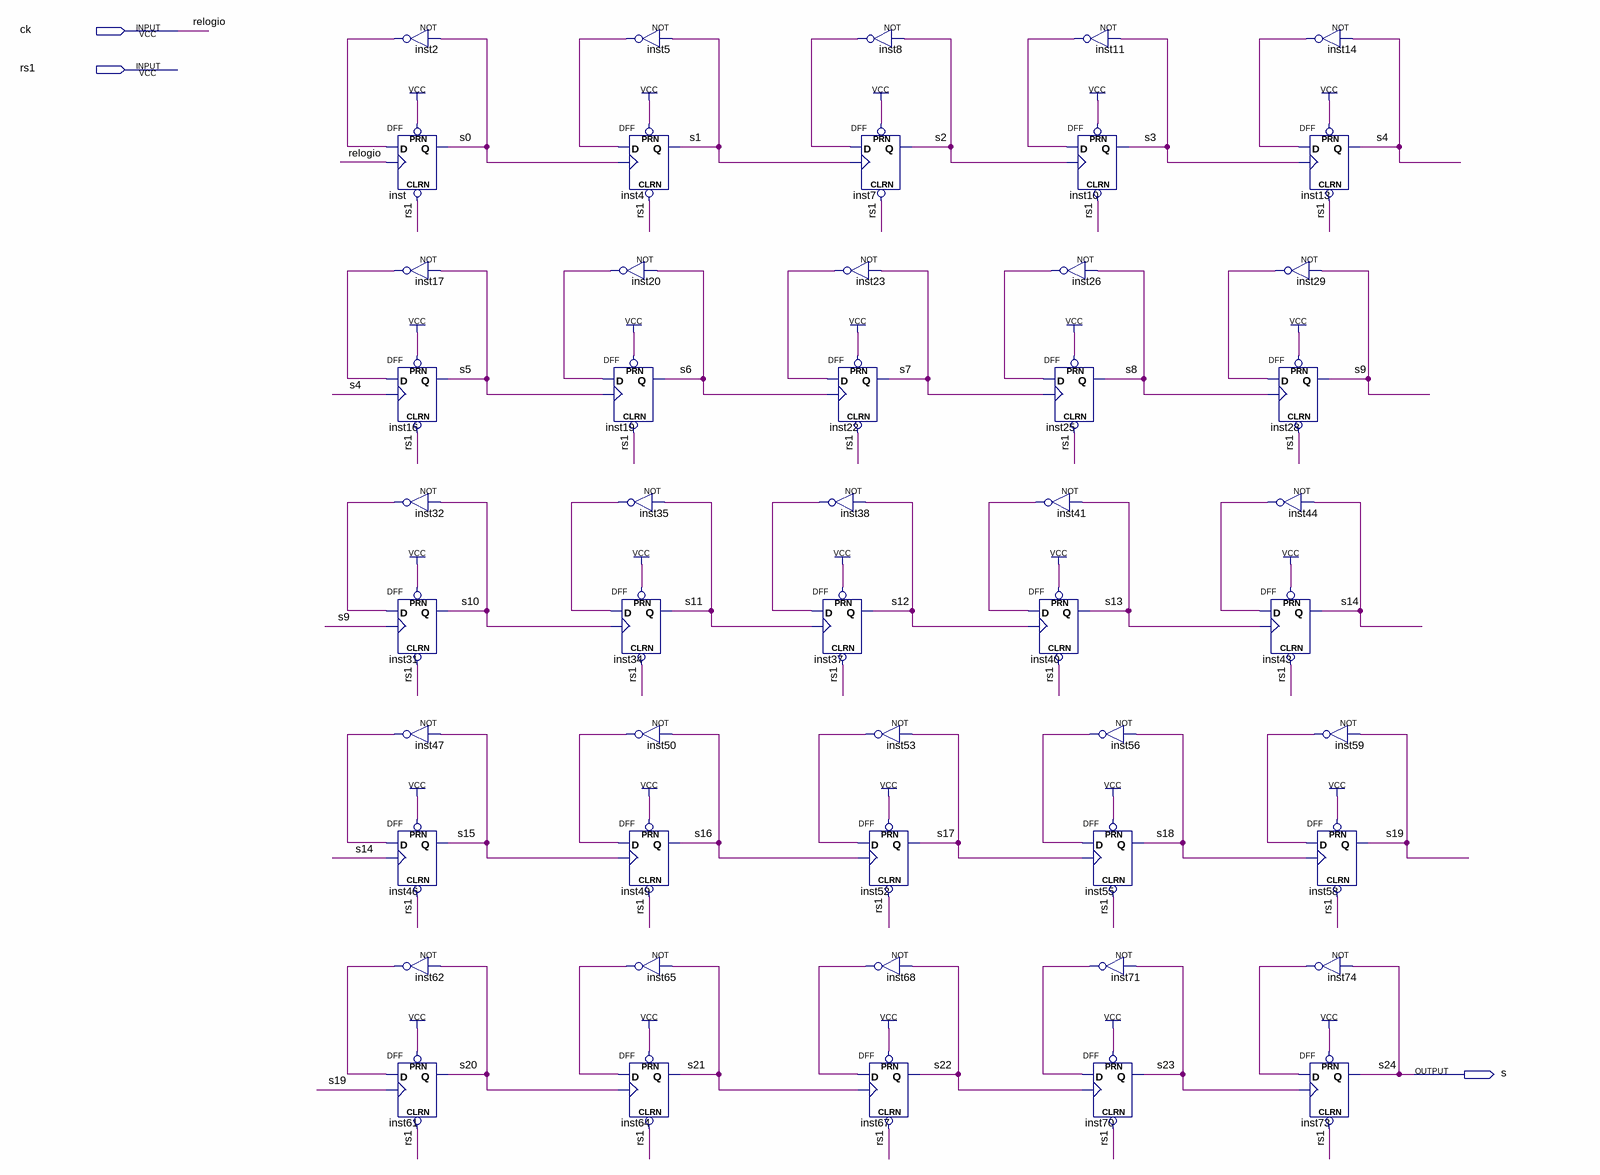
[diagram p0: schematic sheet]
// Quartus schematic abk_div_freq.bdf as structural Verilog: 50 symbols, 3 pins
module abk_div_freq (
  input  ck,
  input  rs1,
  output s
);

  wire inst2_out, inst5_out, inst8_out, inst11_out, inst14_out, inst17_out, inst20_out, inst23_out,
       inst26_out, inst29_out, inst32_out, inst35_out, inst38_out, inst41_out, inst44_out, inst47_out,
       inst50_out, inst53_out, inst56_out, inst59_out, inst62_out, inst65_out, inst68_out, inst71_out,
       inst74_out, s0, s1, s2, s3, s4, s5, s6, s7, s8, s9, s10, s11, s12, s13, s14, s15, s16, s17, s18, s19,
       s20, s21, s22, s23;

  not inst2 (inst2_out, s0);
  DFF inst (.CLRN(rs1), .CLK(ck), .D(inst2_out), .PRN(1'b1), .Q(s0));
  not inst17 (inst17_out, s5);
  DFF inst16 (.CLRN(rs1), .CLK(s4), .D(inst17_out), .PRN(1'b1), .Q(s5));
  not inst32 (inst32_out, s10);
  DFF inst31 (.CLRN(rs1), .CLK(s9), .D(inst32_out), .PRN(1'b1), .Q(s10));
  not inst47 (inst47_out, s15);
  DFF inst46 (.CLRN(rs1), .CLK(s14), .D(inst47_out), .PRN(1'b1), .Q(s15));
  not inst62 (inst62_out, s20);
  DFF inst61 (.CLRN(rs1), .CLK(s19), .D(inst62_out), .PRN(1'b1), .Q(s20));
  not inst5 (inst5_out, s1);
  DFF inst4 (.CLRN(rs1), .CLK(s0), .D(inst5_out), .PRN(1'b1), .Q(s1));
  not inst20 (inst20_out, s6);
  DFF inst19 (.CLRN(rs1), .CLK(s5), .D(inst20_out), .PRN(1'b1), .Q(s6));
  not inst35 (inst35_out, s11);
  DFF inst34 (.CLRN(rs1), .CLK(s10), .D(inst35_out), .PRN(1'b1), .Q(s11));
  not inst50 (inst50_out, s16);
  DFF inst49 (.CLRN(rs1), .CLK(s15), .D(inst50_out), .PRN(1'b1), .Q(s16));
  not inst65 (inst65_out, s21);
  DFF inst64 (.CLRN(rs1), .CLK(s20), .D(inst65_out), .PRN(1'b1), .Q(s21));
  not inst23 (inst23_out, s7);
  DFF inst22 (.CLRN(rs1), .CLK(s6), .D(inst23_out), .PRN(1'b1), .Q(s7));
  not inst38 (inst38_out, s12);
  DFF inst37 (.CLRN(rs1), .CLK(s11), .D(inst38_out), .PRN(1'b1), .Q(s12));
  not inst8 (inst8_out, s2);
  DFF inst7 (.CLRN(rs1), .CLK(s1), .D(inst8_out), .PRN(1'b1), .Q(s2));
  not inst53 (inst53_out, s17);
  DFF inst52 (.CLRN(rs1), .CLK(s16), .D(inst53_out), .PRN(1'b1), .Q(s17));
  not inst68 (inst68_out, s22);
  DFF inst67 (.CLRN(rs1), .CLK(s21), .D(inst68_out), .PRN(1'b1), .Q(s22));
  DFF inst40 (.CLRN(rs1), .CLK(s12), .D(inst41_out), .PRN(1'b1), .Q(s13));
  not inst11 (inst11_out, s3);
  DFF inst10 (.CLRN(rs1), .CLK(s2), .D(inst11_out), .PRN(1'b1), .Q(s3));
  not inst26 (inst26_out, s8);
  DFF inst25 (.CLRN(rs1), .CLK(s7), .D(inst26_out), .PRN(1'b1), .Q(s8));
  not inst41 (inst41_out, s13);
  not inst56 (inst56_out, s18);
  DFF inst55 (.CLRN(rs1), .CLK(s17), .D(inst56_out), .PRN(1'b1), .Q(s18));
  not inst71 (inst71_out, s23);
  DFF inst70 (.CLRN(rs1), .CLK(s22), .D(inst71_out), .PRN(1'b1), .Q(s23));
  not inst29 (inst29_out, s9);
  DFF inst28 (.CLRN(rs1), .CLK(s8), .D(inst29_out), .PRN(1'b1), .Q(s9));
  not inst44 (inst44_out, s14);
  DFF inst43 (.CLRN(rs1), .CLK(s13), .D(inst44_out), .PRN(1'b1), .Q(s14));
  not inst14 (inst14_out, s4);
  DFF inst13 (.CLRN(rs1), .CLK(s3), .D(inst14_out), .PRN(1'b1), .Q(s4));
  not inst59 (inst59_out, s19);
  DFF inst58 (.CLRN(rs1), .CLK(s18), .D(inst59_out), .PRN(1'b1), .Q(s19));
  not inst74 (inst74_out, s);
  DFF inst73 (.CLRN(rs1), .CLK(s23), .D(inst74_out), .PRN(1'b1), .Q(s));

  // Other names for the same wires on the sheet: relogio = ck; s24 = s
endmodule
